# Altium schematic sheet MicroController_Main.SchDoc: MicroController_Main.SchDoc
size A4; Author: flotox@yeah.net; Revision: v1.0.0; SheetNumber: 7; SheetTotal: 10
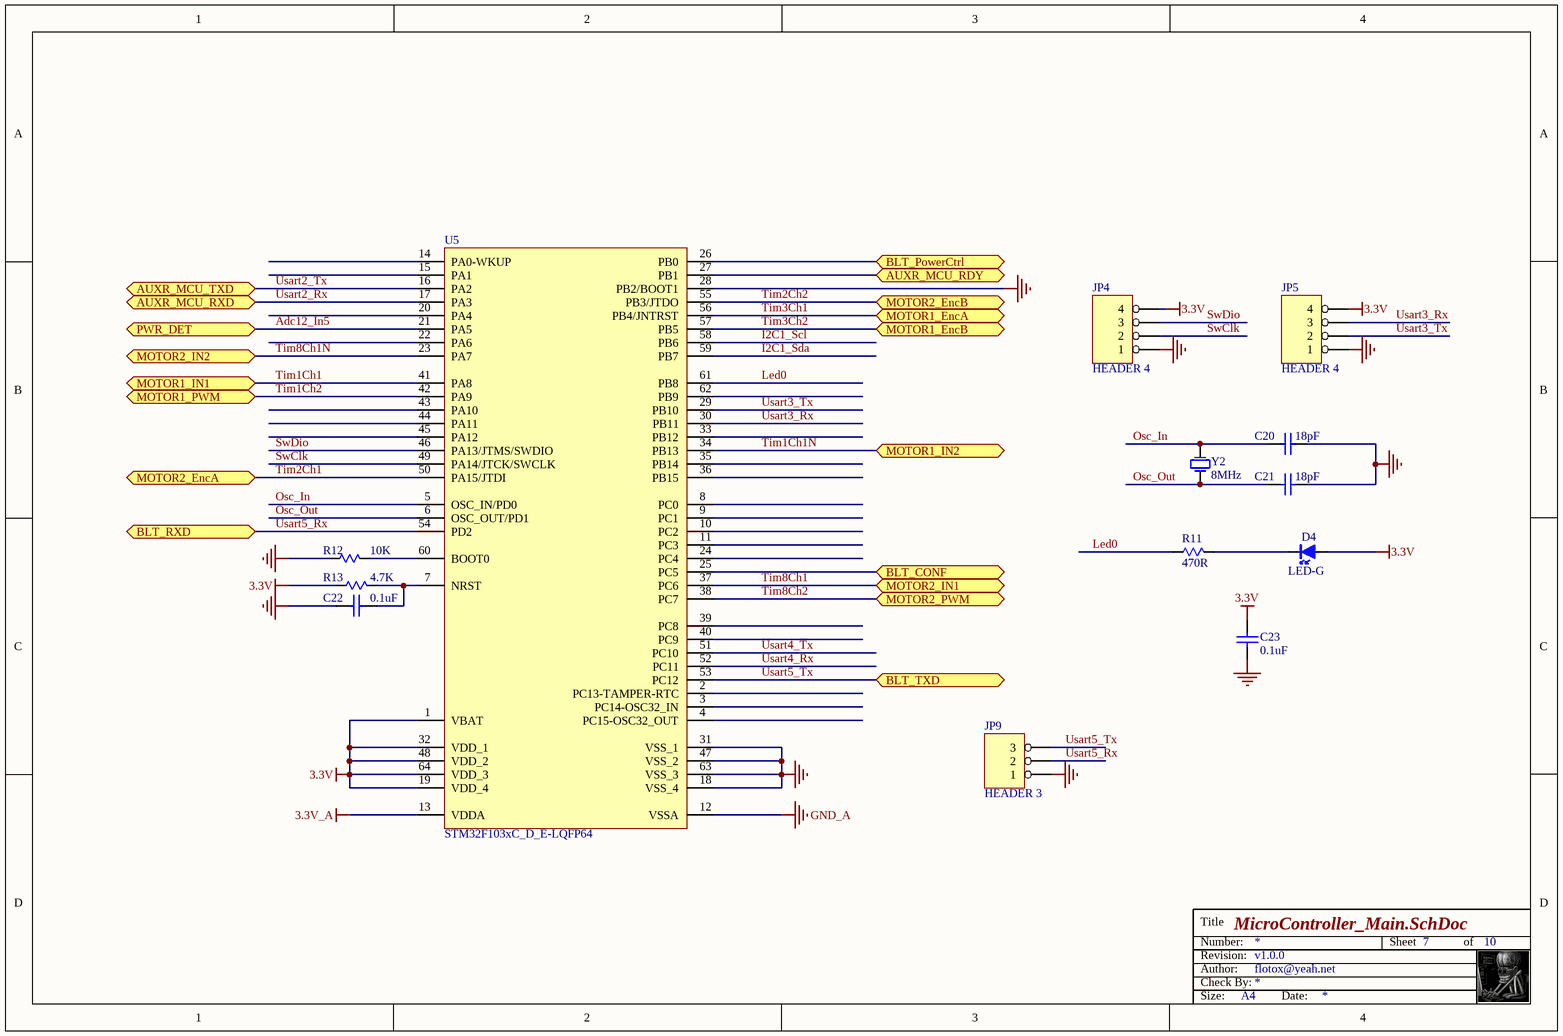
[diagram p0: MicroController_Main.SchDoc]

## Parts
C20  18pF  [C0603-S]
C21  18pF  [C0603-S]
C22  0.1uF  [C0603-S]
C23  0.1uF  [C0603-S]
D4  LED-G  [LED0603]
JP4  HEADER 4  [HDR1X4]
JP5  HEADER 4  [SPOX-4P]
JP9  HEADER 3  [HDR1X3]
R11  470R  [R0603-S]
R12  10K  [R0603-S]
R13  4.7K  [R0603-S]
U5  STM32F103xC_D_E-LQFP64  [LQFP10X10-64]
Y2  8MHz  [XTAL-49SMD]

## Ports
AUXR_MCU_RDY, AUXR_MCU_RXD, AUXR_MCU_TXD, BLT_CONF, BLT_PowerCtrl, BLT_RXD, BLT_TXD, MOTOR1_EncA, MOTOR1_EncB, MOTOR1_IN1, MOTOR1_IN2, MOTOR1_PWM, MOTOR2_EncA, MOTOR2_EncB, MOTOR2_IN1, MOTOR2_IN2, MOTOR2_PWM, PWR_DET

## Nets
3.3V: C23.2 D4.1(A) JP4.4 JP5.4 R13.2 U5.1(VBAT) U5.19(VDD_4) U5.32(VDD_1) U5.48(VDD_2) U5.64(VDD_3)
3.3V_A: U5.13(VDDA)
GND: C20.1 C21.1 C22.2 C23.1 JP4.1 JP5.1 JP9.1 R12.2 U5.18(VSS_4) U5.28(PB2/BOOT1) U5.31(VSS_1) U5.47(VSS_2) U5.63(VSS_3)
GND_A: U5.12(VSSA)
Adc12_In5: U5.21(PA5) ; port PWR_DET
AUXR_MCU_RDY: U5.27(PB1) ; port AUXR_MCU_RDY
BLT_CONF: U5.25(PC5) ; port BLT_CONF
BLT_PowerCtrl: U5.26(PB0) ; port BLT_PowerCtrl
I2C1_Scl: U5.58(PB6)
I2C1_Sda: U5.59(PB7)
Led0: R11.2 U5.61(PB8)
Osc_In: C20.2 U5.5(OSC_IN/PD0) Y2.1(OSC1)
Osc_Out: C21.2 U5.6(OSC_OUT/PD1) Y2.2(OSC2)
SwClk: JP4.2 U5.49(PA14/JTCK/SWCLK)
SwDio: JP4.3 U5.46(PA13/JTMS/SWDIO)
Tim1Ch1: U5.41(PA8) ; port MOTOR1_IN1
Tim1Ch1N: U5.34(PB13) ; port MOTOR1_IN2
Tim1Ch2: U5.42(PA9) ; port MOTOR1_PWM
Tim2Ch1: U5.50(PA15/JTDI) ; port MOTOR2_EncA
Tim2Ch2: U5.55(PB3/JTDO) ; port MOTOR2_EncB
Tim3Ch1: U5.56(PB4/JNTRST) ; port MOTOR1_EncA
Tim3Ch2: U5.57(PB5) ; port MOTOR1_EncB
Tim8Ch1: U5.37(PC6) ; port MOTOR2_IN1
Tim8Ch1N: U5.23(PA7) ; port MOTOR2_IN2
Tim8Ch2: U5.38(PC7) ; port MOTOR2_PWM
Usart2_Rx: U5.17(PA3) ; port AUXR_MCU_RXD
Usart2_Tx: U5.16(PA2) ; port AUXR_MCU_TXD
Usart3_Rx: JP5.3 U5.30(PB11)
Usart3_Tx: JP5.2 U5.29(PB10)
Usart4_Rx: U5.52(PC11)
Usart4_Tx: U5.51(PC10)
Usart5_Rx: JP9.2 U5.54(PD2) ; port BLT_RXD
Usart5_Tx: JP9.3 U5.53(PC12) ; port BLT_TXD
NetC22_1: C22.1 R13.1 U5.7(NRST)
NetD4_2: D4.2(K) R11.1
NetR12_1: R12.1 U5.60(BOOT0)

Not connected (* = marked no-connect by the designer): U5 2(PC13-TAMPER-RTC) 3(PC14-OSC32_IN) 4(PC15-OSC32_OUT) 8(PC0) 9(PC1) 10(PC2) 11(PC3) 14(PA0-WKUP) 15(PA1) 20(PA4) 22(PA6) 24(PC4) 33(PB12) 35(PB14) 36(PB15) 39(PC8) 40(PC9) 43(PA10) 44(PA11) 45(PA12) 62(PB9)

## Notes on the sheet
- Title
- Revision:
- Number:
- Author:
- Check By:
- Sheet
- of
- Size:
- A4
- Date:

## Library data of the parts
C20-C23 = CAP: Capacitor
D4 = LED: Light Emitting Diode
R11-R13 = RES: Resistor
U5 = STM32F103xC_D_E-LQFP64: High-density performance line ARM-based 32-bit MCU with 256 to 512KB Flash, USB, CAN, 11 timers, 3 ADCs, 13 communication interfaces
Y2 = XTAL-CRYSTALS: Crystals